# EAGLE design FLC-148 - Rotary Encoder w. push FFC (EAGLE 9.4.0)
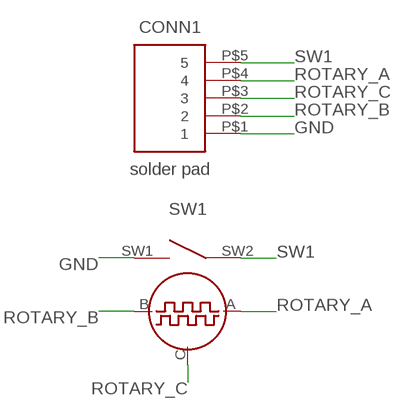
[diagram p0: schematic, sheet 1]

## Parts
CONN1  solder pad  FFC_END-5P_1MM_PITCH  [SMD]
SW1  ED089050-FE18C9.0-C10-2D0_PUSH  [TH]

## Nets
GND: CONN1.P$1 SW1.SW1
ROTARY_A: CONN1.P$4 SW1.A
ROTARY_B: CONN1.P$2 SW1.B
ROTARY_C: CONN1.P$3 SW1.C
SW1: CONN1.P$5 SW1.SW2

## Library data of the parts
CONN1 = FFC end 5P 1mm pitch:FFC_END-5P_1MM_PITCH
SW1 = ED089050-FE18C9.0-C10-2D0 Rotary Encoder w. push:ED089050-FE18C9.0-C10-2D0_PUSH

## Board
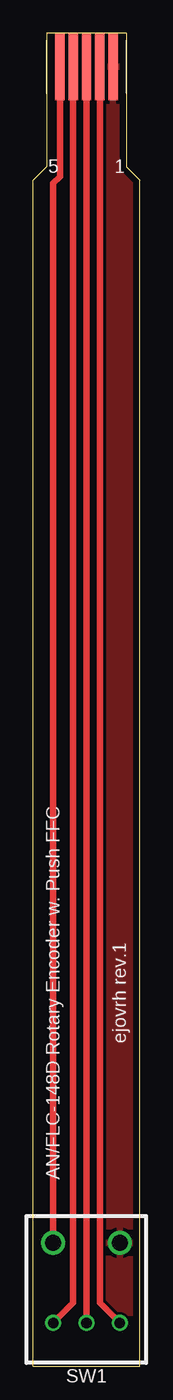
[diagram p1: board, top side]
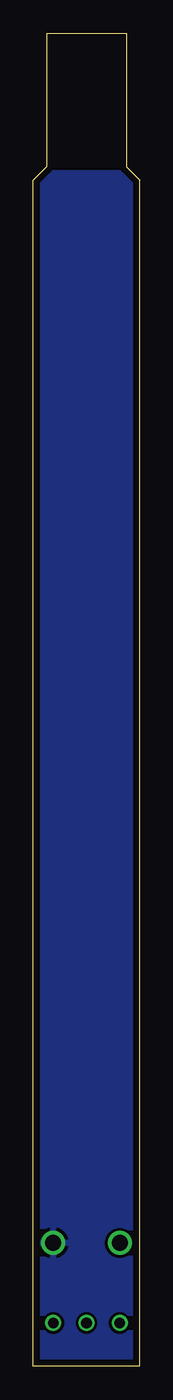
[diagram p2: board, bottom side, seen from below]

Size 8 x 100 mm. Coordinates in mm from the lower left corner, seen from the top.
Outline: 0,0 8,0 8,89 7,90 7,100 1,100 1,90 0,89 0,0
Copper layers (1*16): Top 0.035mm / dielectric 1.5mm / Bottom 0.035mm
Design rules "markovac_2layer": minimum track width 0.2mm, minimum drill 0.35mm, track to track 0.2mm, track to pad 0.2mm, pad to pad 0.2mm, via to via 0.2mm, smd to smd 0.2mm, copper to edge 0.5mm, drill to drill 8mil, minimum pad ring 0.15mm, minimum via ring 0.15mm, stop-mask expansion 4mil, vias tented up to drill 0.34mm, thermal gap 10mil

### Footprints (pad centres in the part's own frame; a part is rotated, then mirrored left to right if it is on the bottom)
SMD = smd 0.7 x 5: P$1 -2,0; P$2 -1,0; P$3 0,0; P$4 1,0; P$5 2,0
TH = drill 0.8: A 2.5,6; B -2.5,6; C 0,6 | drill 1.2: SW1 -2.5,0; SW2 2.5,0

### Placement (x,y rotation side)
CONN1  4,97.5 180 top
SW1  4,9.25 180 top

### Tracks (layer width: path | path; a pad name or v marks a point on that pad's centre or on a via)
GND
  pour Top: -1,-1 9,-1 9,101 -1,101
  pour Bottom: 9,89.5 -1,89.5 -1,-1 9,-1
ROTARY_A
  Top 0.5: CONN1.P$4 3,10 3,9.75 3,4.75 SW1.A
ROTARY_B
  Top 0.5: CONN1.P$2 5,10 5,9.75 5,4.75 SW1.B
ROTARY_C
  Top 0.5: SW1.C CONN1.P$3
SW1
  Top 0.5: SW1.SW2 1.5,88.75 2,89.25 CONN1.P$5

### Text on the board
tPlace: 5 | 1 | AN/FLC-148D Rotary Encoder w. Push FFC | ejovrh rev.1